# EAGLE design d_enc_v3 (EAGLE 7.2.0)
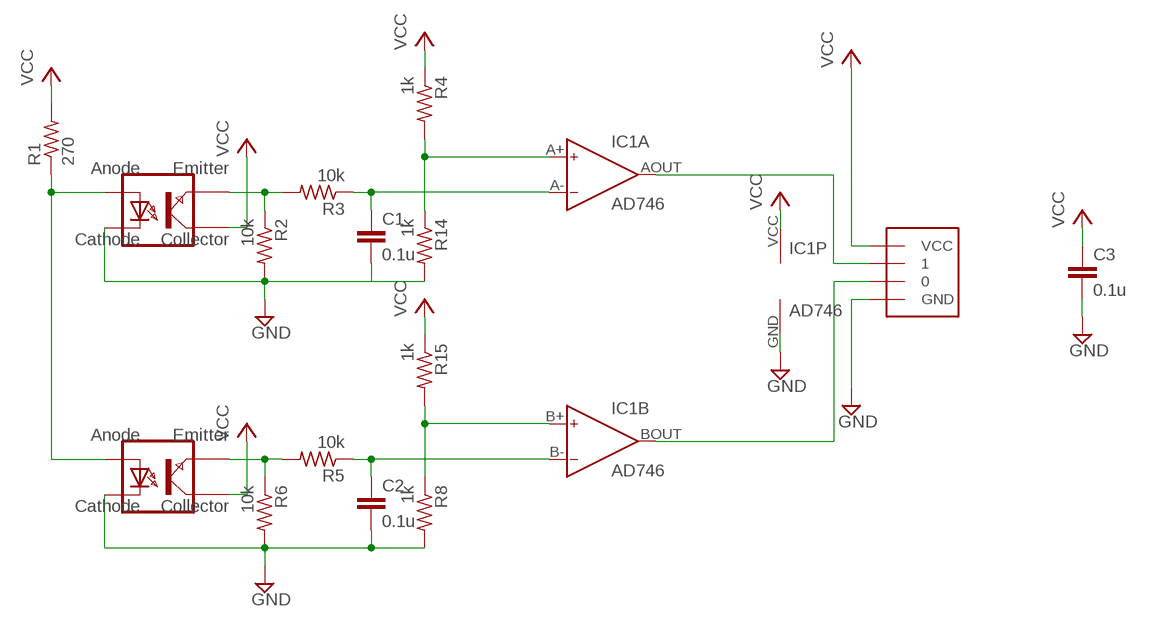
[diagram p0: schematic, sheet 1]

## Parts
C1  0.1u  C-EUC0603  [C0603]
C2  0.1u  C-EUC0603  [C0603]
C3  0.1u  C-EUC0603  [C0603]
IC1  AD746  [NJM2903E]
R1  270  R-US_R0603  [R0603]
R2  10k  R-US_R0603  [R0603]
R3  10k  R-US_R0603  [R0603]
R4  1k  R-US_R0603  [R0603]
R5  10k  R-US_R0603  [R0603]
R6  10k  R-US_R0603  [R0603]
R8  1k  R-US_R0603  [R0603]
R14  1k  R-US_R0603  [R0603]
R15  1k  R-US_R0603  [R0603]
U$1  TPR-105F  [TPR-105F]
U$2  ENC_CON  [ENC_CON]
U$4  TPR-105F  [TPR-105F]

## Nets
GND: C1.2 C2.2 C3.2 IC1.GND(P:V-) R2.2 R6.2 R8.2 R14.2 U$1.CATHODE U$2.GND U$4.CATHODE
N$1: C1.1 IC1.A-(A:IN-) R3.1
N$2: R1.1 U$1.ANODE U$4.ANODE
N$3: R2.1 R3.2 U$4.EMITTER
N$4: R5.2 R6.1 U$1.EMITTER
N$6: C2.1 IC1.B-(B:IN-) R5.1
N$7: IC1.AOUT(A:OUT) U$2.1
N$8: IC1.BOUT(B:OUT) U$2.0
N$12: IC1.B+(B:IN+) R8.1 R15.2
N$14: IC1.A+(A:IN+) R4.2 R14.1
VCC: C3.1 IC1.VCC(P:V+) R1.2 R4.1 R15.1 U$1.COLLECTOR U$2.VCC U$4.COLLECTOR

## Library data of the parts
C1-C3 = rcl:C-EU: CAPACITOR, European symbol
IC1 = analog-devices:AD746: Dual Precision, 500 ns Settling, BiFET Op Amp Source: http://www.analog.com/static/imported-files/data_sheets/AD746.pdf
R1-R6 R8 R14 R15 = rcl:R-US_: RESISTOR, American symbol
U$1 U$4 = lbr-127hld:TPR-105F
U$2 = ENC_CON:ENC_CON

## Board
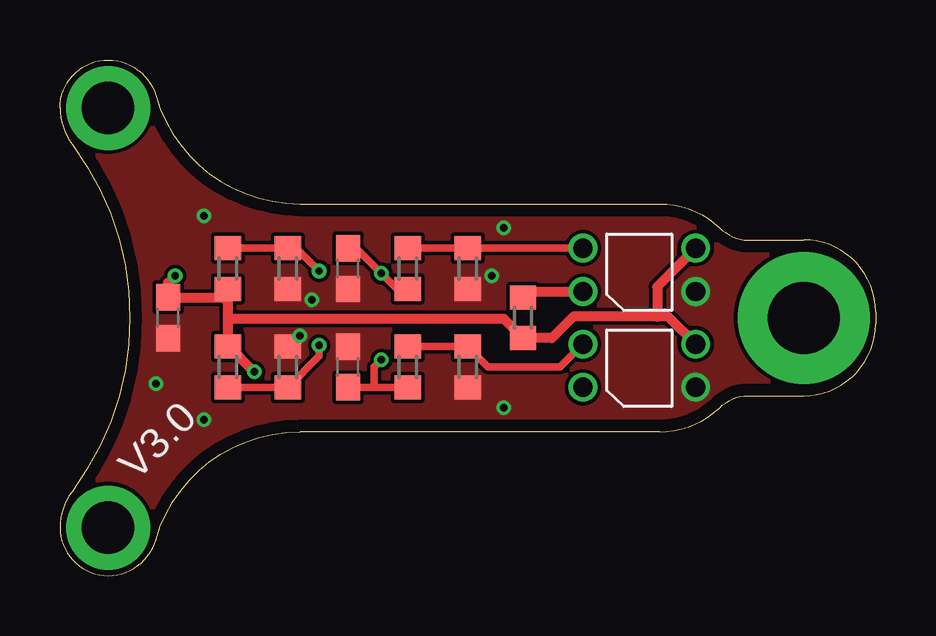
[diagram p1: board, top side]
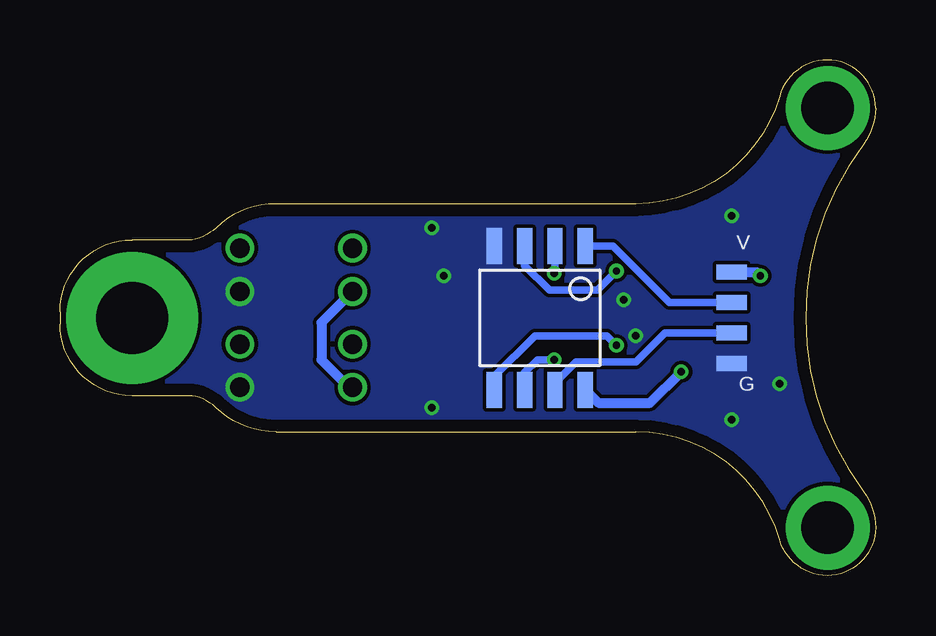
[diagram p2: board, bottom side, seen from below]

Size 34 x 21.5 mm. Coordinates in mm from the lower left corner, seen from the top.
Outline: 0,19.5 arc-90 2,21.5 arc-74 4,20 arc74 10,15.5 25,15.5 arc-44 27.5,14.5 arc34 28.5,14 31,14 arc-90 34,11 34,10.5 arc-90 31,7.5 28.5,7.5 arc34 27.5,7 arc-44 25,6 10,6 arc74 4,1.5 arc-74 2,0 arc-90 0,2 arc-37 0.5,3.5 arc74 0.5,18 arc-37 0,19.5
Copper layers (1*16): Top 0.035mm / dielectric 1.6mm / Bottom 0.035mm
Design rules "Elecrow_2-layer_PCB_eagle_rule": minimum track width 6mil, minimum drill 12mil, track to track 6mil, track to pad 6mil, pad to pad 6mil, via to via 8mil, smd to smd 0mil, copper to edge 20mil, drill to drill 10mil, minimum pad ring 6mil, minimum via ring 6mil, stop-mask expansion 0mil, vias tented up to drill 100mil, thermal gap 10mil

### Footprints (pad centres in the part's own frame; a part is rotated, then mirrored left to right if it is on the bottom)
C0603 = smd 1.1 x 1: 1 -0.85,0; 2 0.85,0
NJM2903E = smd 1.5 x 0.635: A+ -3,-0.63; A- -3,0.63; AOUT -3,1.9; B+ 3,-1.9; B- 3,-0.63; BOUT 3,0.63; GND -3,-1.9; VCC 3,1.9
R0603 = smd 1 x 1.1: 1 -0.85,0; 2 0.85,0
TPR-105F = drill 0.8: ANODE 3.7,2.4; CATHODE -1,2.4; COLLECTOR -1,0.6; EMITTER 3.7,0.6
ENC_CON = smd 0.635 x 1.27: 0 0.635,0; 1 -0.635,0; GND 1.905,0; VCC -1.905,0

### Placement (x,y rotation side)
C1  12,12.8 270 top
C2  12,8.7 90 top
C3  4.5,10.75 270 top
IC1  14,10.75 270 bottom
R1  19.3,10.75 270 top
R2  17,12.8 270 top
R3  14.5,12.8 90 top
R4  7,12.8 90 top
R5  14.5,8.7 90 top
R6  17,8.7 270 top
R8  9.5,8.7 90 top
R14  9.5,12.8 270 top
R15  7,8.7 270 top
U$1  25.5,10.25 180 top
U$2  6,10.75 270 bottom
U$4  25.5,14.25 180 top

### Tracks (layer width: path | path; a pad name or v marks a point on that pad's centre or on a via)
GND  (via drill 0.3)
  other vias: 6,15 6,6.5 4,8 10.5,11.5 10,10 18,12.5 18.5,14.5 18.5,7
  pour Top (rank 6, no thermals): -22,38 48,38 48,-7 -22,-7
  pour Bottom (rank 6, no thermals): -17,33 43,33 43,-4 -17,-4
N$1  (via drill 0.3)
  Top 0.305: R3.1 14.05,11.95 v13.4,12.6 12.35,13.65 C1.1
  Bottom 0.305: IC1.A- 13.37,12.63 v13.4,12.6
N$2
  Top 0.406: R1.1 19.55,11.85 U$4.ANODE
  Bottom 0.406: U$4.ANODE 23.1,10.55 23.1,9 21.95,7.85 U$1.ANODE
N$3
  Top 0.305: U$4.EMITTER R2.1 R3.2
N$4
  Top 0.305: U$1.EMITTER 20.85,8.7 17.85,8.7 R6.1 R5.2
N$6  (via drill 0.3)
  Top 0.305: C2.1 13.1,7.85 | 13.1,7.85 R5.1 | v13.4,9 13.1,8.7 13.1,7.85
  Bottom 0.305: IC1.B- 14.63,8.47 14.1,9 v13.4,9
N$7
  Bottom 0.305: U$2.1 8.59,11.38 10.95,13.75 IC1.AOUT
N$8
  Bottom 0.305: IC1.BOUT 13.37,8.03 12.5,8.9 10,8.9 8.79,10.12 U$2.0
N$9  (via drill 2.2 pad 3.5)
  other vias: 2,19.5
N$10  (via drill 2.2 pad 3.5)
  other vias: 2,2
N$11  (via drill 3 pad 5.5)
  other vias: 31,10.75
N$12  (via drill 0.3)
  Top 0.305: R15.2 R8.1 10.8,9.15 v10.8,9.6
  Bottom 0.305: IC1.B+ 15.9,8.3 14.2,10 11.2,10 v10.8,9.6
N$14  (via drill 0.3)
  Top 0.305: R4.2 R14.1 9.85,13.65 v10.8,12.7
  Bottom 0.305: v10.8,12.7 11.6,11.9 13.6,11.9 14.63,12.93 IC1.A+
VCC  (via drill 0.3)
  Top 0.406: v4.8,12.5 4.5,12.2 C3.1 6.8,11.6 7,11.4 | 7,10.7 R15.1 7.05,9.55 v8.1,8.5 | 7,10.7 7,11.4 | 7,11.4 R4.1 | 7,10.7 18.5,10.7 R1.2 20.5,9.9 21.4,10.8 24.9,10.8 | U$1.COLLECTOR 25.35,10.8 24.9,10.8 | U$4.COLLECTOR 24.9,12.05 24.9,10.8
  Bottom 0.406: U$2.VCC 4.96,12.65 v4.8,12.5 | IC1.VCC 11.55,7.2 9.4,7.2 v8.1,8.5

### Text on the board
tNames: V3.0
bNames: V | G
Measures: φ2.2mm | φ3.0mm